# Altium schematic sheet 原理图.SchDoc
size A4
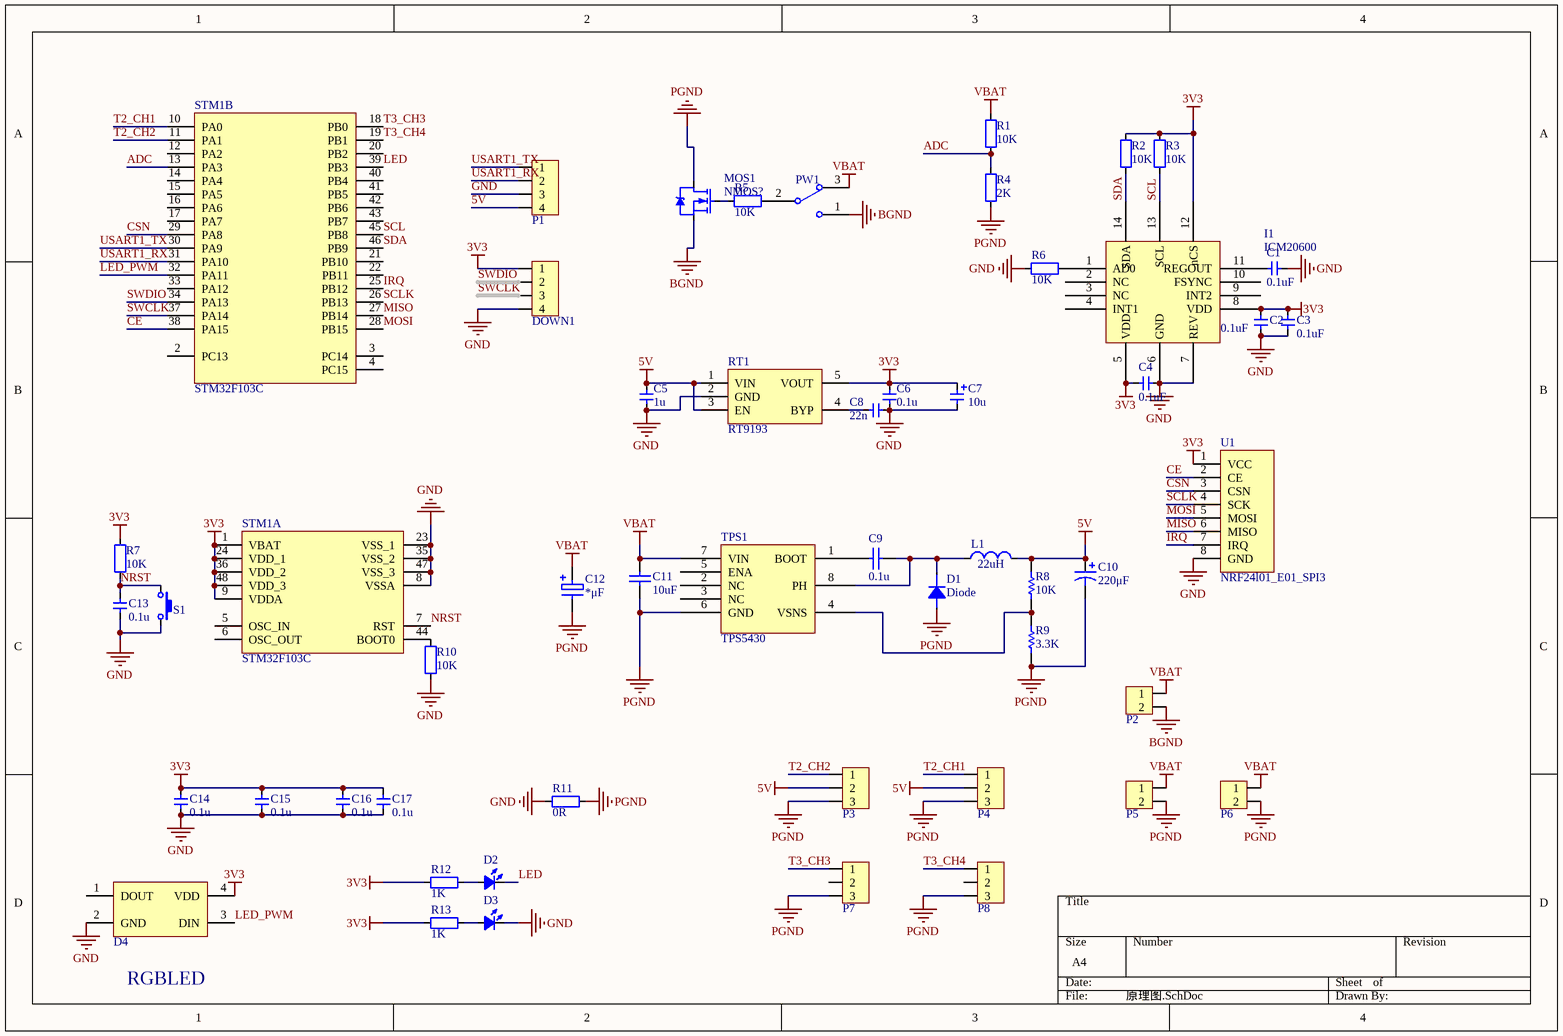
[diagram p0: 原理图.SchDoc]

## Parts
C1  value 0.1uF  [CAP_0603]  (hidden comment: Cap_0603)
C2  value 0.1uF  [CAP_0603]  (hidden comment: Cap_0603)
C3  value 0.1uF  [CAP_0603]  (hidden comment: Cap_0603)
C4  value 0.1uF  [CAP_0603]  (hidden comment: Cap_0603)
C5  value 1u  [CAP_0603]  (hidden comment: Cap_0603)
C6  value 0.1u  [CAP_0603]  (hidden comment: Cap_0603)
C7  value 10u  [CAP_TAN_P0805]  (hidden comment: Cap_Tan_0805)
C8  value 22n  [CAP_0603]  (hidden comment: Cap_0603)
C9  value 0.1u  [CAP-MLCC-0603]  (hidden comment: Cap)
C10  220μF  [CAP-TAN-6032/CAPC]
C11  value 10uF  [0805C]  (hidden comment: Cap)
C12  *μF  [C_ELE]
C13  value 0.1u  [CAP_0603]  (hidden comment: Cap_0603)
C14  value 0.1u  [CAP_0603]  (hidden comment: Cap_0603)
C15  value 0.1u  [CAP_0603]  (hidden comment: Cap_0603)
C16  value 0.1u  [CAP_0603]  (hidden comment: Cap_0603)
C17  value 0.1u  [CAP_0603]  (hidden comment: Cap_0603)
D1  Diode  [SS34]
D2  LED_0805  [LED_0805_RED]  (value not drawn)
D3  LED_0805  [LED_0805_RED]  (value not drawn)
D4  LED_3535_SK6812  [LED_3535_4P]  (value not drawn)
DOWN1  HDR1x4_2.54  [HDR1x4_2.54_180]  (value not drawn)
I1  ICM20600  [ICM20600]
L1  value 22uH  [CD74]  (hidden comment: Ind-CD52)
MOS1  value NMOS?  [TO-252AA]  (hidden comment: MOSFET_N)
P1  HDR1x4_2.54  [HDR1x4_2.54_180]  (value not drawn)
P2  Connector  [Green 2P]  (value not drawn)
P3  HDR1x3_2.54  [HDR1X3_2.54_180]  (value not drawn)
P4  HDR1x3_2.54  [HDR1X3_2.54_180]  (value not drawn)
P5  Connector  [2P_SMD]  (value not drawn)
P6  Connector  [2P_SMD]  (value not drawn)
P7  HDR1x3_2.54  [HDR1X3_2.54_180]  (value not drawn)
P8  HDR1x3_2.54  [HDR1X3_2.54_180]  (value not drawn)
PW1  SwitchSPDT_2.8x6.6_90  [SwitchSPDT_2.8X6.6_90]  (value not drawn)
R1  value 10K  [RES_0603]  (hidden comment: Res_0603)
R2  value 10K  [RES_0603]  (hidden comment: Res_0603)
R3  value 10K  [RES_0603]  (hidden comment: Res_0603)
R4  value 2K  [RES_0603]  (hidden comment: Res_0603)
R5  value 10K  [RES_0603]  (hidden comment: Res_0603)
R6  value 10K  [RES_0603]  (hidden comment: Res_0603)
R7  value 10K  [RES_0603]  (hidden comment: Res_0603)
R8  value 10K  [RES-0603]  (hidden comment: Res1)
R9  value 3.3K  [RES-0603]  (hidden comment: Res1)
R10  value 10K  [RES_0603]  (hidden comment: Res_0603)
R11  value 0R  [RES_0603]  (hidden comment: Res_0603)
R12  value 1K  [RES_0603]  (hidden comment: RES_0805)
R13  value 1K  [RES_0603]  (hidden comment: RES_0805)
RT1  RT9193  [SOT23-5]
S1  ButtonTACT_3x4x2_180  [ButtonTACT_3x4x2_180H]  (value not drawn)
STM1  STM32F103C  [LQFP_P0.5_48]  (parts A,B of 2)
TPS1  TPS5430  [SOP_E150_8 -with_PADs]
U1  NRF24l01_E01_SPI3  [E01-ML01SP2]

## Nets
3V3: C2.1 C3.1 C4.2 C6.2 C7.1 C14.2 C15.2 C16.2 C17.2 D4.4(VDD) DOWN1.1 I1.5(VDD) I1.8(VDD) I1.12(nCS) R2.1 R3.1 R7.1 R12.1 R13.1 RT1.5(VOUT) STM1.1(VBAT) STM1.9(VDDA) STM1.24(VDD_1) STM1.36(VDD_2) STM1.48(VDD_3) U1.1(VCC)
5V: C5.2 C10.1 L1.2 P1.4 P3.2 P4.2 R8.2 RT1.1(VIN) RT1.3(EN)
BGND: MOS1.3(S) P2.2 PW1.1
GND: C1.2 C2.2 C3.2 C4.1 C5.1 C6.1 C7.2 C8.1 C13.1 C14.1 C15.1 C16.1 C17.1 D3.2(K) D4.2(GND) DOWN1.4 I1.6(GND) I1.7(REV) P1.3 R6.1 R10.2 R11.1 RT1.2(GND) S1.2 STM1.8(VSSA) STM1.23(VSS_1) STM1.35(VSS_2) STM1.47(VSS_3) U1.8(GND)
PGND: C10.2 C11.1 C12.2 D1.A MOS1.4(D) P3.3 P4.3 P5.2 P6.2 P7.3 P8.3 R4.1 R9.1 R11.2 TPS1.6(GND)
VBAT: C11.2 C12.1 P2.1 P5.1 P6.1 PW1.3 R1.2 TPS1.7(VIN)
ADC: R1.1 R4.2 STM1.13(PA3)
CE: STM1.38(PA15) U1.2(CE)
CSN: STM1.29(PA8) U1.3(CSN)
IRQ: STM1.25(PB12) U1.7(IRQ)
LED: D2.2(K) STM1.39(PB3)
LED_PWM: D4.3(DIN) STM1.32(PA11)
MISO: STM1.27(PB14) U1.6(MISO)
MOSI: STM1.28(PB15) U1.5(MOSI)
NRST: C13.2 R7.2 S1.1 STM1.7(RST)
SCL: I1.13(SCL) R3.2 STM1.45(PB8)
SCLK: STM1.26(PB13) U1.4(SCK)
SDA: I1.14(SDA) R2.2 STM1.46(PB9)
SWCLK: DOWN1.3 STM1.37(PA14)
SWDIO: DOWN1.2 STM1.34(PA13)
T2_CH1: P4.1 STM1.10(PA0)
T2_CH2: P3.1 STM1.11(PA1)
T3_CH3: P7.1 STM1.18(PB0)
T3_CH4: P8.1 STM1.19(PB1)
USART1_RX: P1.2 STM1.31(PA10)
USART1_TX: P1.1 STM1.30(PA9)
NetC1_1: C1.1 I1.11(REGOUT)
NetC8_2: C8.2 RT1.4(BYP)
NetC9_1: C9.1 D1.K L1.1 TPS1.8(PH)
NetC9_2: C9.2 TPS1.1(BOOT)
NetD2_1: D2.1(A) R12.2
NetD3_1: D3.1(A) R13.2
NetI1_1: I1.1(AD0) R6.2
NetMOS1_1: MOS1.1(G) R5.1
NetPW1_2: PW1.2 R5.2
NetR8_1: R8.1 R9.2 TPS1.4(VSNS)
NetR10_1: R10.1 STM1.44(BOOT0)

Not connected (* = marked no-connect by the designer): D4 1(DOUT); I1 2(NC) 3(NC) 4(INT1) 9(INT2) 10(FSYNC); P7 2; P8 2; STM1 2(PC13) 3(PC14) 4(PC15) 5(OSC_IN) 6(OSC_OUT) 12(PA2) 14(PA4) 15(PA5) 16(PA6) 17(PA7) 20(PB2) 21(PB10) 22(PB11) 33(PA12) 40(PB4) 41(PB5) 42(PB6) 43(PB7); TPS1 2(NC) 3(NC) 5(ENA)

## Notes on the sheet
- (near D4) RGBLED

## Library data of the parts
C1-C6 C8 C13-C17 = Cap_0603: Capacitor
C7 = Cap_Tan_0805: Capacitor
C9 = Cap_1: Capacitor; Published: 8-Jun-2000; LatestRevisionDate: 17-Jul-2002; LatestRevisionNote: Re-released for DXP Platform.; PackageReference: RAD-0.3; Publisher: Altium Limited
C10 = CAP-TAN: 钽电容; Value: *μF; Published: 8-Jun-2000; LatestRevisionDate: 17-Jul-2002; LatestRevisionNote: Re-released for DXP Platform.; PackageReference: POLAR0.8; Publisher: Altium Limited; PackageDescription: Polarized Capacitor; 2 Leads
C11 = Cap: Capacitor; Published: 8-Jun-2000; LatestRevisionDate: 17-Jul-2002; LatestRevisionNote: Re-released for DXP Platform.; PackageReference: RAD-0.3; Publisher: Altium Limited
C12 = CAP-ELE: 电解电容; Published: 8-Jun-2000; LatestRevisionDate: 17-Jul-2002; LatestRevisionNote: Re-released for DXP Platform.; PackageReference: RB7.6-15; Publisher: Altium Limited; PackageDescription: Polarized Capacitor (Radial); 2 Leads; Value: *μF
D2 D3 = LED_0805: LED
D4 = LED_3535_SK6812: LED
DOWN1 P1 = HDR1x4_2.54: Header
L1 = Ind_CD52: Inductor
MOS1 = MOSFET_N: MOSFET
P2 P5 P6 = 2P
P3 P4 P7 P8 = HDR1x3_2.54: Header
PW1 = SwitchSPDT_2.8x6.6_90: Switch
R1-R7 R10 R11 = Res_0603: Resistor
R8 R9 = Res1: Resistor; Published: 8-Jun-2000; LatestRevisionDate: 17-Jul-2002; LatestRevisionNote: Re-released for DXP Platform.; PackageReference: AXIAL-0.3; Publisher: Altium Limited
R12 R13 = RES_0805: Resistor
RT1 = RT9193: Power
S1 = ButtonTACT_3x4x2_180: Button
STM1 = STM32F103C: MCU
U1 = NRF24l01_E01_SPI2